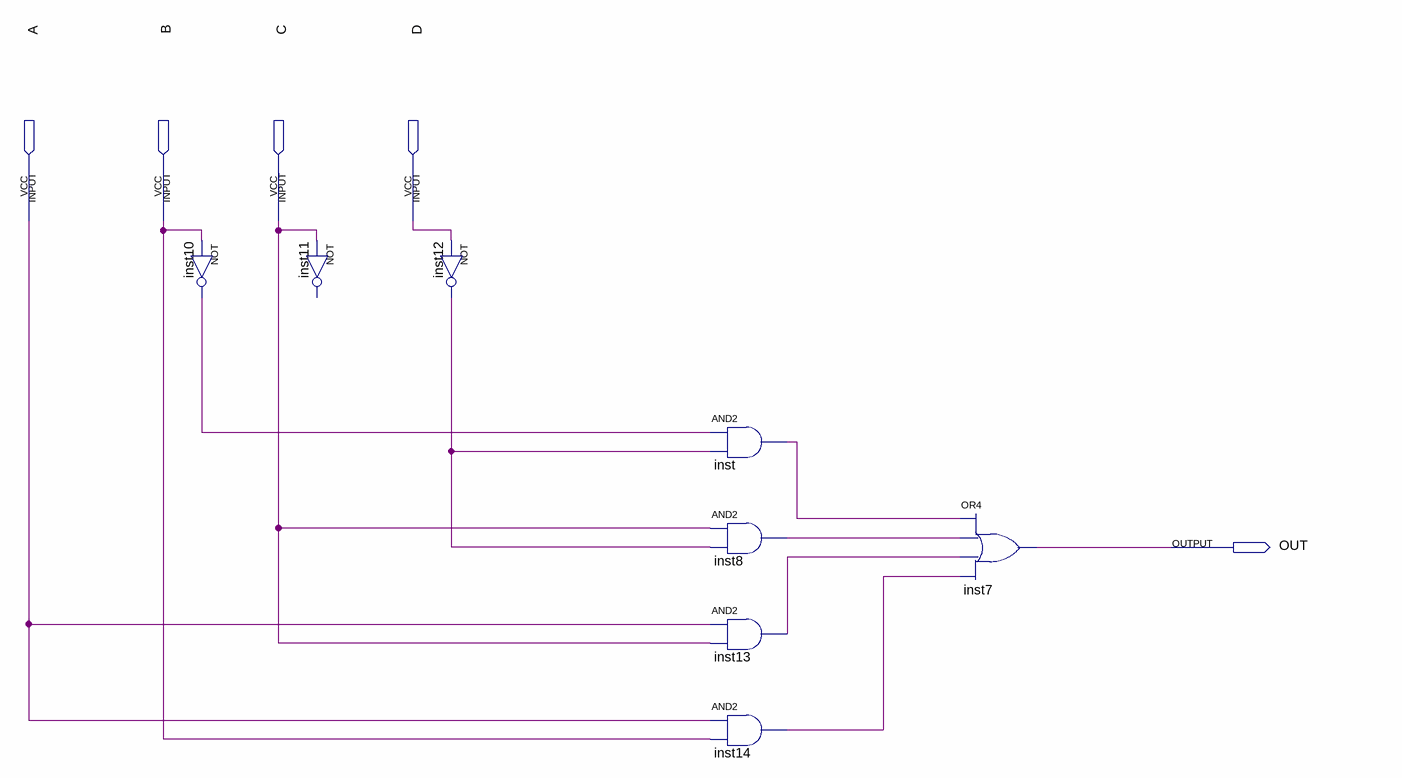
[diagram p0: schematic sheet]
// Quartus schematic ledE.bdf as structural Verilog: 8 symbols, 5 pins
module ledE (
  input  A,
  input  B,
  input  C,
  input  D,
  output OUT
);

  wire inst8_out, inst10_out, inst12_out, inst13_out, inst14_out, inst_out;

  not inst10 (inst10_out, B);
  // NOT inst11 has open pins: IN=C, OUT=open
  not inst12 (inst12_out, D);
  and inst (inst_out, inst10_out, inst12_out);
  and inst8 (inst8_out, C, inst12_out);
  and inst13 (inst13_out, A, C);
  and inst14 (inst14_out, A, B);
  or inst7 (OUT, inst_out, inst8_out, inst13_out, inst14_out);
endmodule
